# Altium schematic sheet AD8253.SchDoc
size A4
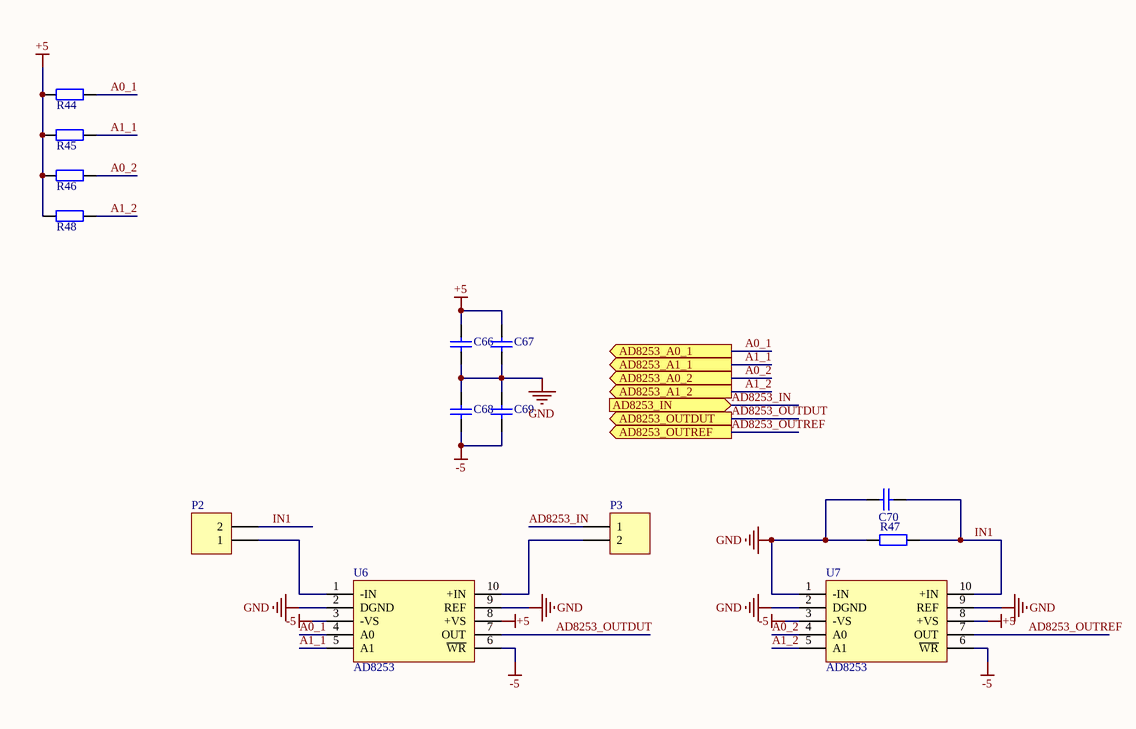
[diagram p0: AD8253.SchDoc]

## Parts
C66  100nF (104) 10% 50V  [0603_C]  (value not drawn)
C67  100nF (104) 10% 50V  [0603_C]  (value not drawn)
C68  100nF (104) 10% 50V  [0603_C]  (value not drawn)
C69  100nF (104) 10% 50V  [0603_C]  (value not drawn)
C70  1.5nF (152) 10% 50V  [0603_C]  (value not drawn)
P2  PORT_Header 2  [tow_pad_top]  (value not drawn)
P3  PORT_Header 2  [tow_pad_top]  (value not drawn)
R44  110Ω (1100) ±1%  [0603_R]  (value not drawn)
R45  110Ω (1100) ±1%  [0603_R]  (value not drawn)
R46  110Ω (1100) ±1%  [0603_R]  (value not drawn)
R47  110Ω (1100) ±1%  [0603_R]  (value not drawn)
R48  110Ω (1100) ±1%  [0603_R]  (value not drawn)
U6  AD8253  [MSOP10_M]
U7  AD8253  [MSOP10_M]

## Ports
AD8253_A0_1 (out), AD8253_A0_2 (out), AD8253_A1_1 (out), AD8253_A1_2 (out), AD8253_IN (in), AD8253_OUTDUT (out), AD8253_OUTREF (out)

## Nets
+5: C66.2 C67.2 R44.2 R45.2 R46.2 R48.2 U6.8(+VS) U7.8(+VS)
-5: C68.1 C69.1 U6.3(-VS) U6.6(~{WR}) U7.3(-VS) U7.6(~{WR})
GND: C66.1 C67.1 C68.2 C69.2 C70.2 R47.1 U6.2(DGND) U6.9(REF) U7.1(-IN) U7.2(DGND) U7.9(REF)
A0_1: R44.1 U6.4(A0) ; port AD8253_A0_1
A0_2: R46.1 U7.4(A0) ; port AD8253_A0_2
A1_1: R45.1 U6.5(A1) ; port AD8253_A1_1
A1_2: R48.1 U7.5(A1) ; port AD8253_A1_2
AD8253_IN: P3.1 ; port AD8253_IN
AD8253_OUTDUT: U6.7(OUT) ; port AD8253_OUTDUT
AD8253_OUTREF: U7.7(OUT) ; port AD8253_OUTREF
IN1: C70.1 P2.2 R47.2 U7.10(+IN)
NetP2_1: P2.1 U6.1(-IN)
NetP3_2: P3.2 U6.10(+IN)

## Library data of the parts
C66-C69 = 0603 100nF (104) 10% 50V: 贴片电容; ComponentLink1Description: 供应商链接; ComponentLink1URL: http://www.szlcsc.com/product/details_15331.html; Package: 0603; Supplier: LC; SuppliersPartNumber: C14663
C70 = 0603 1.5nF (152) 10% 50V: 贴片电容; ComponentLink1Description: 供应商链接; ComponentLink1URL: http://www.szlcsc.com/product/details_1947.html; Package: 0603; Supplier: LC; SuppliersPartNumber: C1595
P2 P3 = PORT_Header 2: Header, 2-Pin; LatestRevisionDate: 17-Jul-2002; LatestRevisionNote: Re-released for DXP Platform.; Publisher: Altium Limited
R44-R48 = 0603 110Ω (1100) 1%: 贴片电阻; ComponentLink1Description: 供应商链接; ComponentLink1URL: http://www.szlcsc.com/product/details_23508.html; Package: 0603; Supplier: LC; SuppliersPartNumber: C22781